# Altium schematic sheet Drive.SchDoc
size A4; Organization: Altium Limited; Address1: L3, 12a Rodborough Rd; Address2: Frenchs Forest; Address3: NSW; Address4: Australia 2086
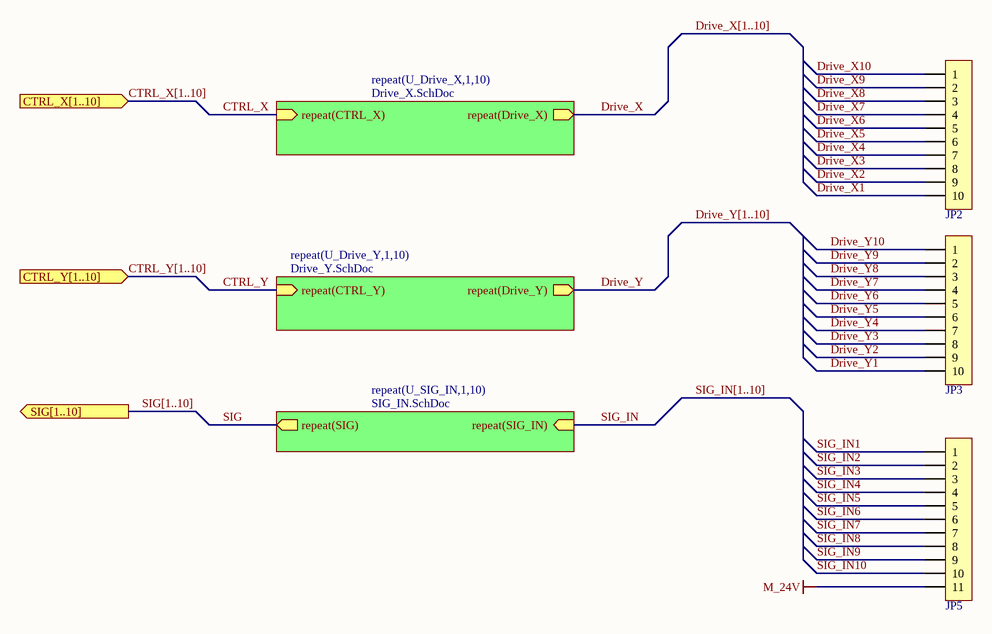
[diagram p0: Drive.SchDoc]

## Parts
JP2  XH2.54-10P  [XH2.54-10P]  (value not drawn)
JP3  XH2.54-10P  [XH2.54-10P]  (value not drawn)
JP5  XH2.54-11P  [XH2.54-11P]  (value not drawn)

## Sub-sheets
repeat(U_Drive_X,1,10) = Drive_X.SchDoc: repeat(CTRL_X) (in), repeat(Drive_X) (out)
repeat(U_Drive_Y,1,10) = Drive_Y.SchDoc: repeat(CTRL_Y) (in), repeat(Drive_Y) (out)
repeat(U_SIG_IN,1,10) = SIG_IN.SchDoc: repeat(SIG) (out), repeat(SIG_IN) (in)

## Ports
CTRL_X[1..10] (in), CTRL_Y[1..10] (in), SIG[1..10] (out)

## Nets
M_24V: JP5.11
CTRL_X: sheet repeat(U_Drive_X,1,10)/repeat(CTRL_X)
CTRL_Y: sheet repeat(U_Drive_Y,1,10)/repeat(CTRL_Y)
Drive_X: sheet repeat(U_Drive_X,1,10)/repeat(Drive_X)
Drive_X1: JP2.10
Drive_X2: JP2.9
Drive_X3: JP2.8
Drive_X4: JP2.7
Drive_X5: JP2.6
Drive_X6: JP2.5
Drive_X7: JP2.4
Drive_X8: JP2.3
Drive_X9: JP2.2
Drive_X10: JP2.1
Drive_Y: sheet repeat(U_Drive_Y,1,10)/repeat(Drive_Y)
Drive_Y1: JP3.10
Drive_Y2: JP3.9
Drive_Y3: JP3.8
Drive_Y4: JP3.7
Drive_Y5: JP3.6
Drive_Y6: JP3.5
Drive_Y7: JP3.4
Drive_Y8: JP3.3
Drive_Y9: JP3.2
Drive_Y10: JP3.1
SIG: sheet repeat(U_SIG_IN,1,10)/repeat(SIG)
SIG_IN: sheet repeat(U_SIG_IN,1,10)/repeat(SIG_IN)
SIG_IN1: JP5.1
SIG_IN2: JP5.2
SIG_IN3: JP5.3
SIG_IN4: JP5.4
SIG_IN5: JP5.5
SIG_IN6: JP5.6
SIG_IN7: JP5.7
SIG_IN8: JP5.8
SIG_IN9: JP5.9
SIG_IN10: JP5.10

## Buses and harness runs
bus CTRL_X[1..10] = port CTRL_X[1..10]
bus CTRL_Y[1..10] = port CTRL_Y[1..10]
bus Drive_X[1..10]
bus Drive_Y[1..10]
bus SIG[1..10] = port SIG[1..10]
bus SIG_IN[1..10]

## Notes on the sheet
- Title
- Size:
- Date:
- A4
- Number:
- Time:
- Revision:
- Sheet
- of
- File:

## Library data of the parts
JP2 JP3 = Header 10: 10P接插件; 版权归属: 源创客; BOM名称: 10P接插件; 学习资源: www.ooocke.com
JP5 = Header 11: 11P接插件; 版权归属: 源创客; BOM名称: 11P接插件; 学习资源: www.ooocke.com